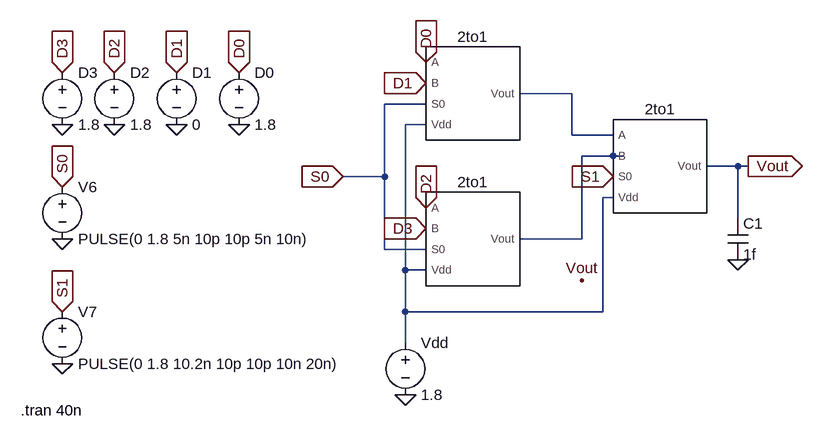
[diagram p0: schematic Mux4to1.asc]
Mux4to1.asc, the LTspice schematic file:
Version 4.1
SHEET 1 880 680
WIRE 256 16 176 16
WIRE 32 32 -32 32
WIRE 32 64 0 64
WIRE 256 80 256 16
WIRE 320 80 256 80
WIRE 320 112 272 112
WIRE 336 112 320 112
WIRE 512 128 464 128
WIRE 528 128 512 128
WIRE -32 144 -32 32
WIRE -32 144 -96 144
WIRE 320 176 304 176
WIRE 512 208 512 128
WIRE 272 240 272 112
WIRE 272 240 176 240
WIRE -32 256 -32 144
WIRE 32 256 -32 256
WIRE 0 288 0 64
WIRE 32 288 0 288
WIRE 0 352 0 288
WIRE 304 352 304 176
WIRE 304 352 0 352
WIRE 0 400 0 352
FLAG 0 480 0
FLAG -528 64 0
FLAG -352 64 0
FLAG -448 64 0
FLAG -256 64 0
FLAG -528 240 0
FLAG -528 432 0
FLAG -96 144 S0
IOPIN -96 144 In
FLAG -528 160 S0
IOPIN -528 160 In
FLAG 320 144 S1
IOPIN 320 144 In
FLAG -528 352 S1
IOPIN -528 352 In
FLAG 272 304 Vout
FLAG 528 128 Vout
IOPIN 528 128 Out
FLAG -256 -16 D0
IOPIN -256 -16 In
FLAG 32 -32 D0
IOPIN 32 -32 In
FLAG 32 0 D1
IOPIN 32 0 In
FLAG -352 -16 D1
IOPIN -352 -16 In
FLAG -448 -16 D2
IOPIN -448 -16 In
FLAG -528 -16 D3
IOPIN -528 -16 In
FLAG 32 192 D2
IOPIN 32 192 In
FLAG 32 224 D3
IOPIN 32 224 In
FLAG 512 272 0
SYMBOL mux 96 16 R0
SYMATTR InstName 2to1
SYMBOL mux 96 240 R0
SYMATTR InstName 2to1
SYMBOL mux 384 128 R0
SYMATTR InstName 2to1
SYMBOL voltage 0 384 R0
WINDOW 123 0 0 Left 0
WINDOW 39 0 0 Left 0
SYMATTR InstName Vdd
SYMATTR Value 1.8
SYMBOL voltage -352 -32 R0
WINDOW 123 0 0 Left 0
WINDOW 39 0 0 Left 0
SYMATTR InstName D1
SYMATTR Value 0
SYMBOL voltage -256 -32 R0
WINDOW 123 0 0 Left 0
WINDOW 39 0 0 Left 0
SYMATTR InstName D0
SYMATTR Value 1.8
SYMBOL voltage -528 -32 R0
WINDOW 123 0 0 Left 0
WINDOW 39 0 0 Left 0
SYMATTR InstName D3
SYMATTR Value 1.8
SYMBOL voltage -448 -32 R0
WINDOW 123 0 0 Left 0
WINDOW 39 0 0 Left 0
SYMATTR InstName D2
SYMATTR Value 1.8
SYMBOL voltage -528 144 R0
WINDOW 123 0 0 Left 0
WINDOW 39 0 0 Left 0
SYMATTR InstName V6
SYMATTR Value PULSE(0 1.8 5n 10p 10p 5n 10n)
SYMBOL voltage -528 336 R0
WINDOW 123 0 0 Left 0
WINDOW 39 0 0 Left 0
SYMATTR InstName V7
SYMATTR Value PULSE(0 1.8 10.2n 10p 10p 10n 20n)
SYMBOL cap 496 208 R0
SYMATTR InstName C1
SYMATTR Value 1f
TEXT -592 504 Left 2 !.tran 40n

The netlist it stands for:
* Mux4to1.asc
X§2to1 D0 D1 S0 N002 N001 mux  ; pins A B S0 Vdd Vout
X§2to1 D2 D3 S0 N002 N003 mux  ; pins A B S0 Vdd Vout
X§2to1 N001 N003 S1 N002 Vout mux  ; pins A B S0 Vdd Vout
Vdd N002 0 1.8
V§D1 D1 0 0
V§D0 D0 0 1.8
V§D3 D3 0 1.8
V§D2 D2 0 1.8
V6 S0 0 PULSE(0 1.8 5n 10p 10p 5n 10n)
V7 S1 0 PULSE(0 1.8 10.2n 10p 10p 10n 20n)
C1 Vout 0 1f
.tran 40n
.backanno
.end